# EasyEDA Pro project RBrick.eprj

# Schematic Schematic1
Board Name: Brick; Create Date: 2026-04-28; Page Name: P1; Project Name: RBrick; Schematic Name: Schematic1; Update Date: 2026-05-01; Company: EasyEDA.com; Page Size: A4; Version: V1.0
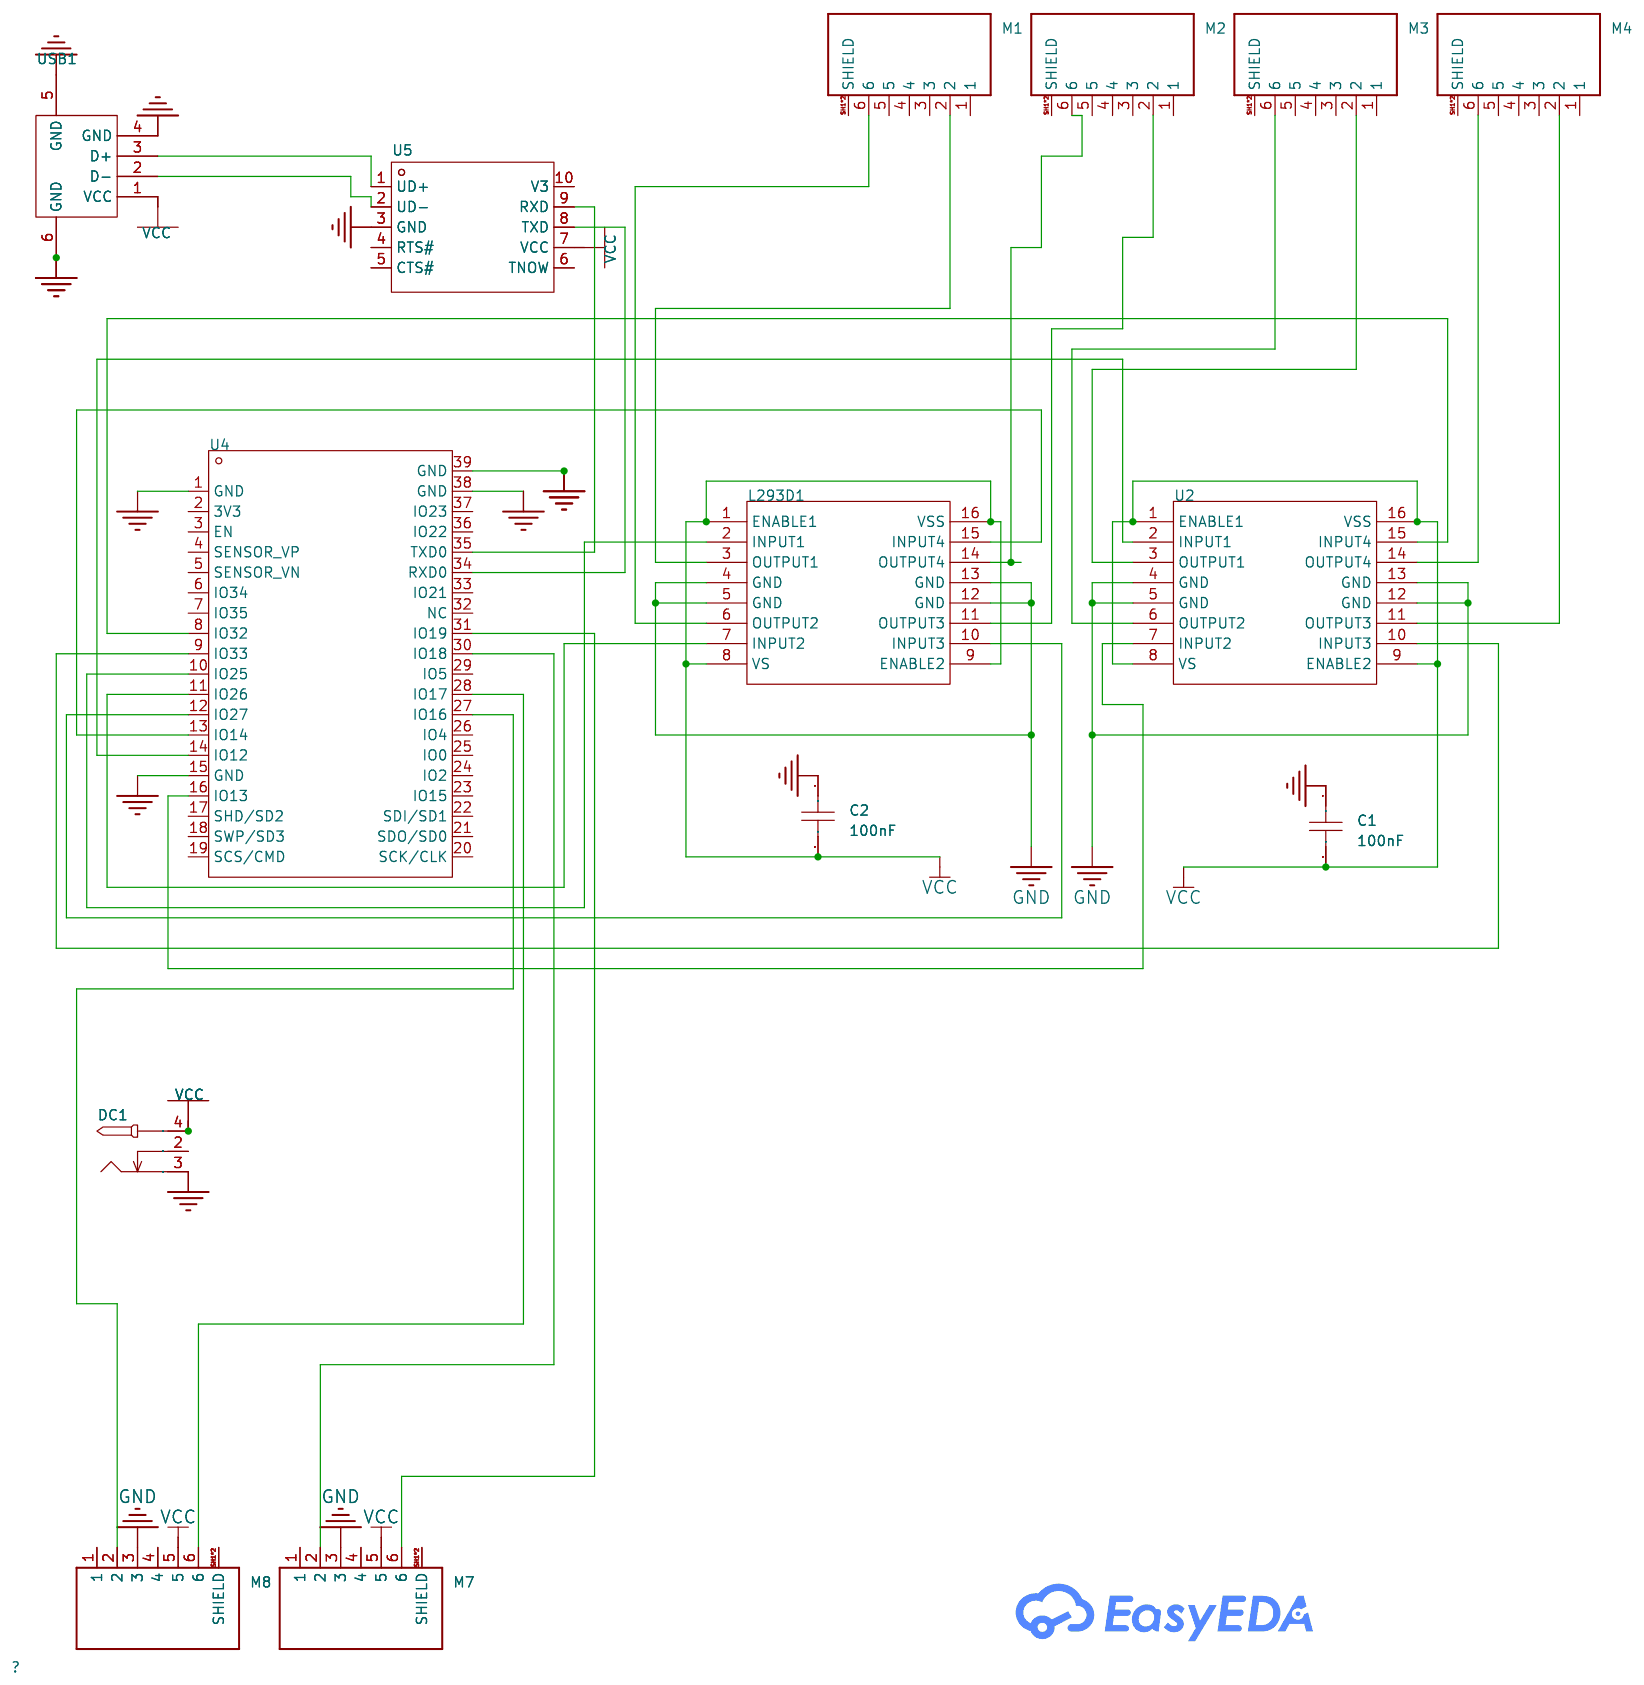
[diagram p0: schematic sheet]

## Parts
C1  100nF  [C0201]
C2  100nF  [C0201]
DC1  -  [DC-IN-TH_DC-5520-1]
L293D1  L293D  [DIP-16_L20.0-W6.4-P2.54-LS7.6-BL]
M1  RJ11-6N4-B  [TE_RJ11-6N4-B]
M2  RJ11-6N4-B  [TE_RJ11-6N4-B]
M3  RJ11-6N4-B  [TE_RJ11-6N4-B]
M4  RJ11-6N4-B  [TE_RJ11-6N4-B]
M7  RJ11-6N4-B  [TE_RJ11-6N4-B]
M8  RJ11-6N4-B  [TE_RJ11-6N4-B]
U2  L293D  [DIP-16_L20.0-W6.4-P2.54-LS7.6-BL]
U4  -  [WIFIM-SMD_ESP-32S]
U5  -  [MSOP-10_L3.0-W3.0-P0.50-LS5.0-BL]
USB1  -  [USB-A-TH_USB-302-T]

## Library data of the parts
C1 C2 = CAP_0201: Supplier Footprint: 0201
DC1 = DC-005_2.0: Supplier Footprint: Through
L293D1 U2 = L293D_C12340: LCSC Part Name: 600mA 有刷直流电机驱动芯片 36V; Supplier Part: C12340; Manufacturer: ST(意法半导体); Supplier Footprint: DIP-16; JLCPCB Part Class: Extended Part; Datasheet: https://item.szlcsc.com/datasheet/L293D/12963.html; Supplier: LCSC; Number of H-bridges: 2; Output Current: 600mA; Peak Current: 1.2A; Voltage - Supply: 4.5V~36V; Quiescent Current(Iq): 4mA; Operating Temperature: -40℃~+150℃
M1-M4 M7 M8 = RJ11-6N4-B
U4 = ESP32-WROOM-32: Supplier Part: C82899; Manufacturer: ESPRESSIF(乐鑫); Supplier Footprint: WIFI无线 Module; JLCPCB Part Class: Extended Part; Datasheet: https://atta.szlcsc.com/upload/public/pdf/source/20210719/C82899_2D52724B6FAFABC419BCF308C5944296.pdf; Supplier: LCSC
U5 = CH340E: Supplier Part: C99652; Manufacturer: WCH(南京沁恒); Supplier Footprint: MSOP-10; JLCPCB Part Class: Extended Part; Datasheet: https://atta.szlcsc.com/upload/public/pdf/source/20200819/C99652_97FFC0DF2539BFF05CD752AD9221D632.pdf; Supplier: LCSC
USB1 = USB-302-T: LCSC Part Name: Type-A 母座 弯插 普通内扣; Supplier Part: C112456; Manufacturer: SOFNG(硕方); Supplier Footprint: 插件; JLCPCB Part Class: Extended Part; Datasheet: https://atta.szlcsc.com/upload/public/pdf/source/20200911/C112456_D145FFFFE3DACD885934CCE0492128DC.pdf; Supplier: LCSC; Connector Type: Type-A; Standard: USB 2.0; Gender: Female; Number of Contacts: 4; Number of Ports: 1; Mounting Style: Shrouded; Current Rating - Power (Max): 50mA; Operating Temperature Range: -25℃~+75℃

## Nets
GND: C1.1 C2.1 DC1.3 L293D1.4(GND) L293D1.5(GND) L293D1.12(GND) L293D1.13(GND) M7.3 M8.3 U2.4(GND) U2.5(GND) U2.12(GND) U2.13(GND) U4.1(GND) U4.15(GND) U4.38(GND) U4.39(GND) U5.3(GND) USB1.4(GND) USB1.5(GND) USB1.6(GND)
VCC: C1.2 C2.2 DC1.4 L293D1.1(ENABLE1) L293D1.8(VS) L293D1.9(ENABLE2) L293D1.16(VSS) M7.5 M8.5 U2.1(ENABLE1) U2.8(VS) U2.9(ENABLE2) U2.16(VSS) U5.7(VCC) USB1.1(VCC)
$1N3161: U2.2(INPUT1) U4.14(IO12)
$1N3822: M3.2 U2.3(OUTPUT1)
$1N3830: M3.6 U2.6(OUTPUT2)
$1N4240: L293D1.3(OUTPUT1) M1.2
$1N4275: M4.2 U2.11(OUTPUT3)
$1N4279: M4.6 U2.14(OUTPUT4)
$1N4306: L293D1.6(OUTPUT2) M1.6
$1N4375: L293D1.11(OUTPUT3) M2.2
$1N4424: L293D1.14(OUTPUT4) M2.6
$1N5365: M8.2 U4.27(IO16)
$1N5372: M8.6 U4.28(IO17)
$1N5379: M7.2 U4.30(IO18)
$1N5395: M7.6 U4.31(IO19)
$1N6263: U2.7(INPUT2) U4.16(IO13)
$1N6284: L293D1.15(INPUT4) U4.13(IO14)
$1N6746: L293D1.2(INPUT1) U4.10(IO25)
$1N6757: L293D1.7(INPUT2) U4.11(IO26)
$1N6766: L293D1.10(INPUT3) U4.12(IO27)
$1N6927: U2.15(INPUT4) U4.8(IO32)
$1N6935: U2.10(INPUT3) U4.9(IO33)
$1N9235: U5.2(UD-) USB1.2(D-)
$1N9237: U5.1(UD+) USB1.3(D+)
$1N9498: U4.35(TXD0) U5.9(RXD)
$1N9505: U4.34(RXD0) U5.8(TXD)

Not connected (* = marked no-connect by the designer): DC1 2; M1 1 3 4 5 SH1*2(SHIELD); M2 1 3 4 5 SH1*2(SHIELD); M3 1 3 4 5 SH1*2(SHIELD); M4 1 3 4 5 SH1*2(SHIELD); M7 1 4 SH1*2(SHIELD); M8 1 4 SH1*2(SHIELD); U4 2(3V3) 3(EN) 4(SENSOR_VP) 5(SENSOR_VN) 6(IO34) 7(IO35) 17(SHD/SD2) 18(SWP/SD3) 19(SCS/CMD) 20(SCK/CLK) 21(SDO/SD0) 22(SDI/SD1) 23(IO15) 24(IO2) 25(IO0) 26(IO4) 29(IO5) 32(NC) 33(IO21) 36(IO22) 37(IO23); U5 4(RTS#) 5(CTS#) 6(TNOW) 10(V3)

# Board PCB1
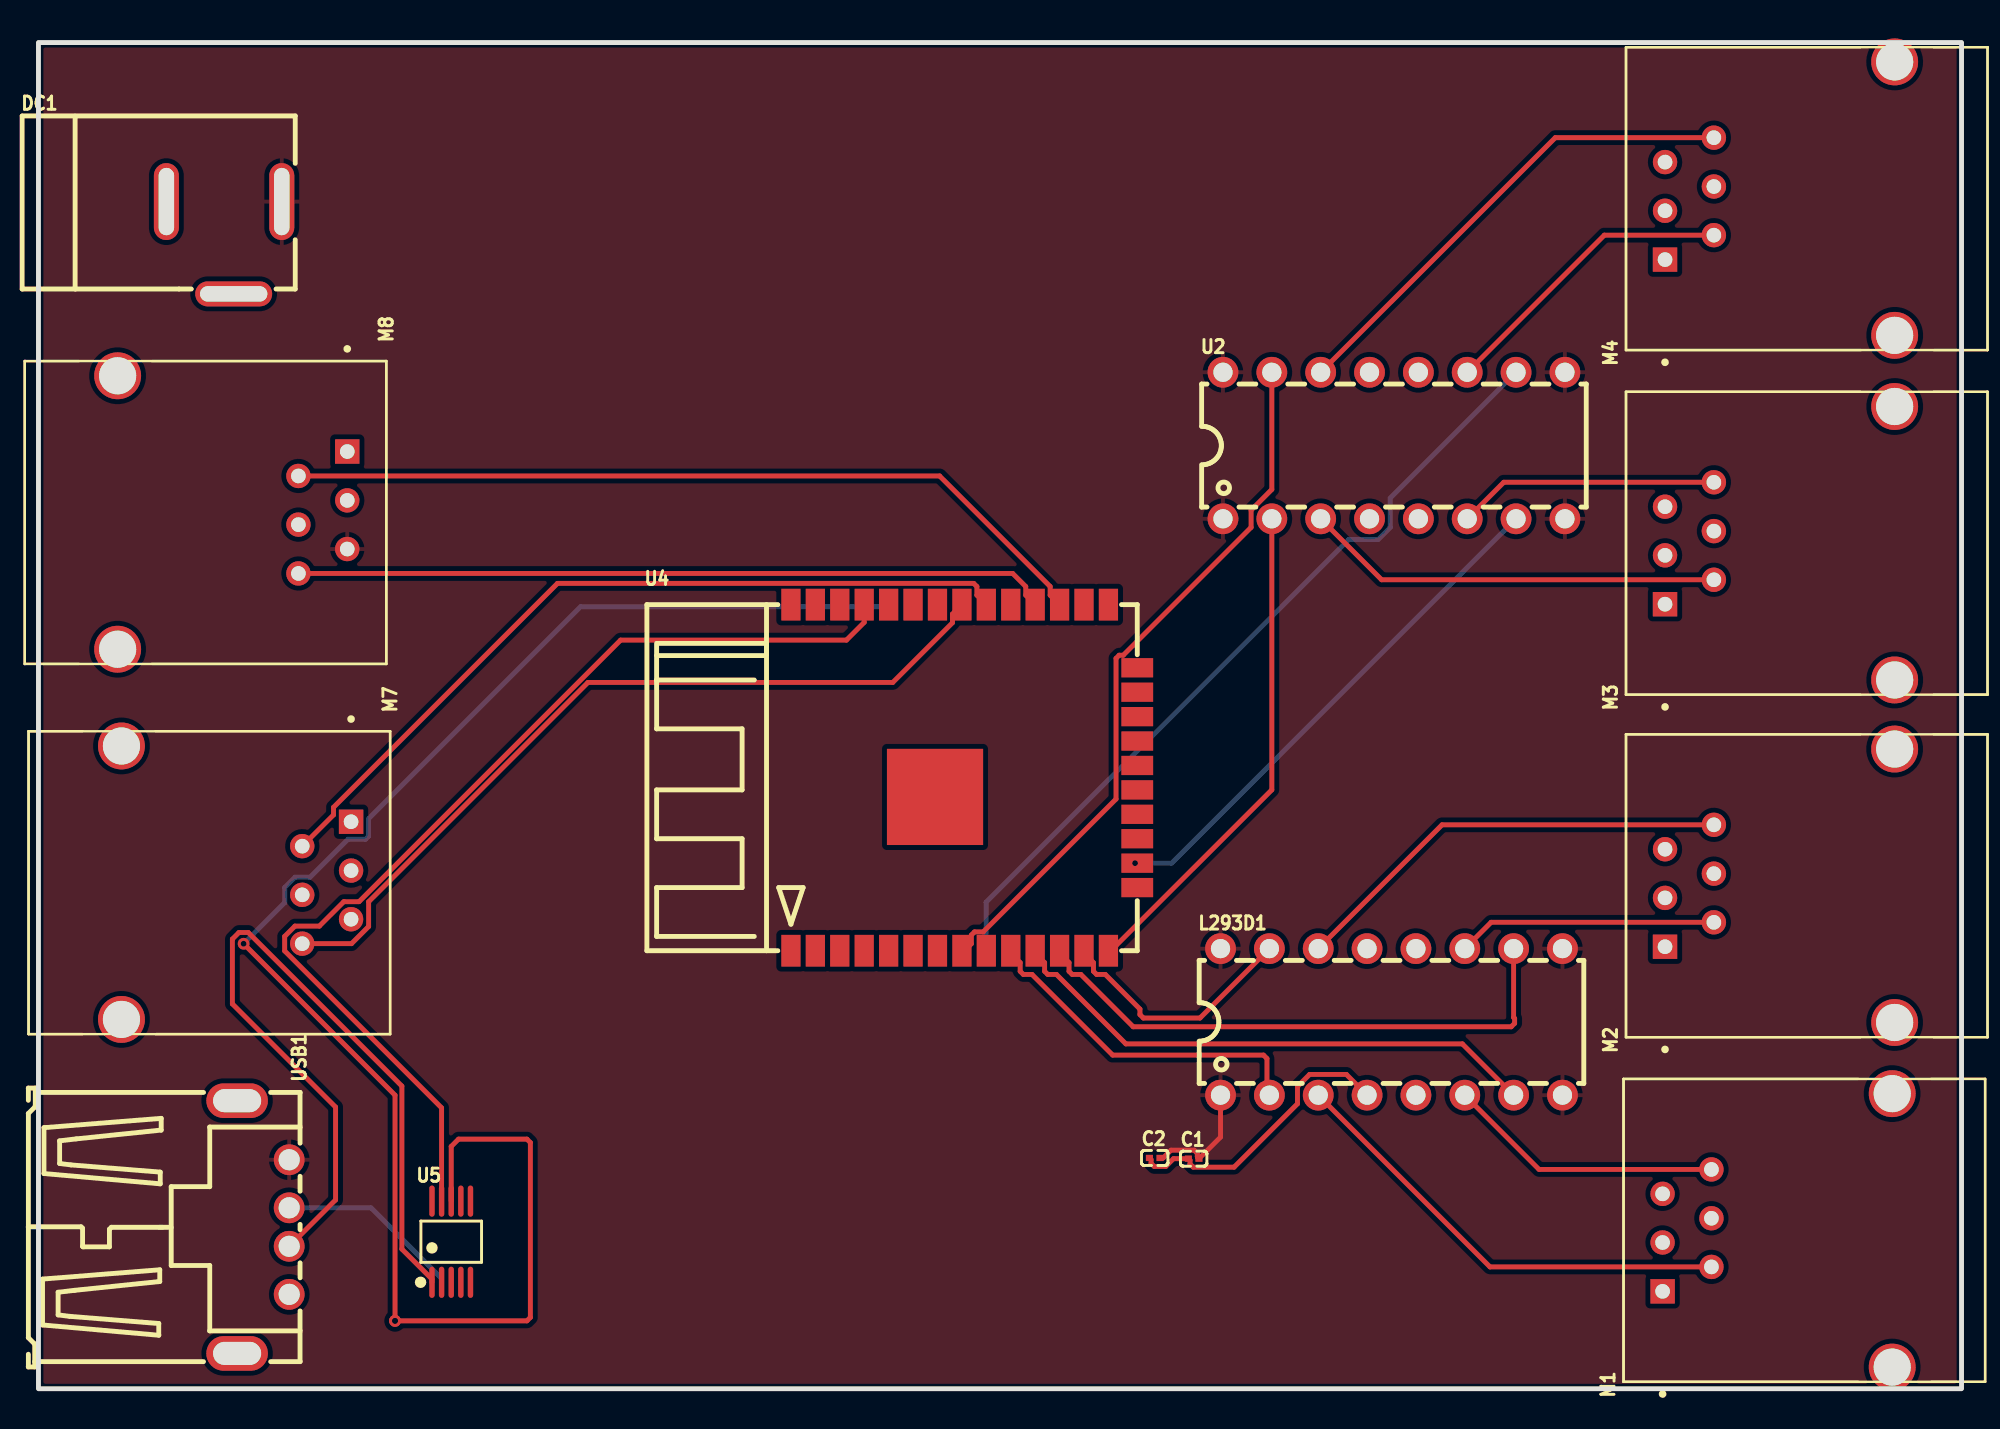
[diagram p1: board, top side]
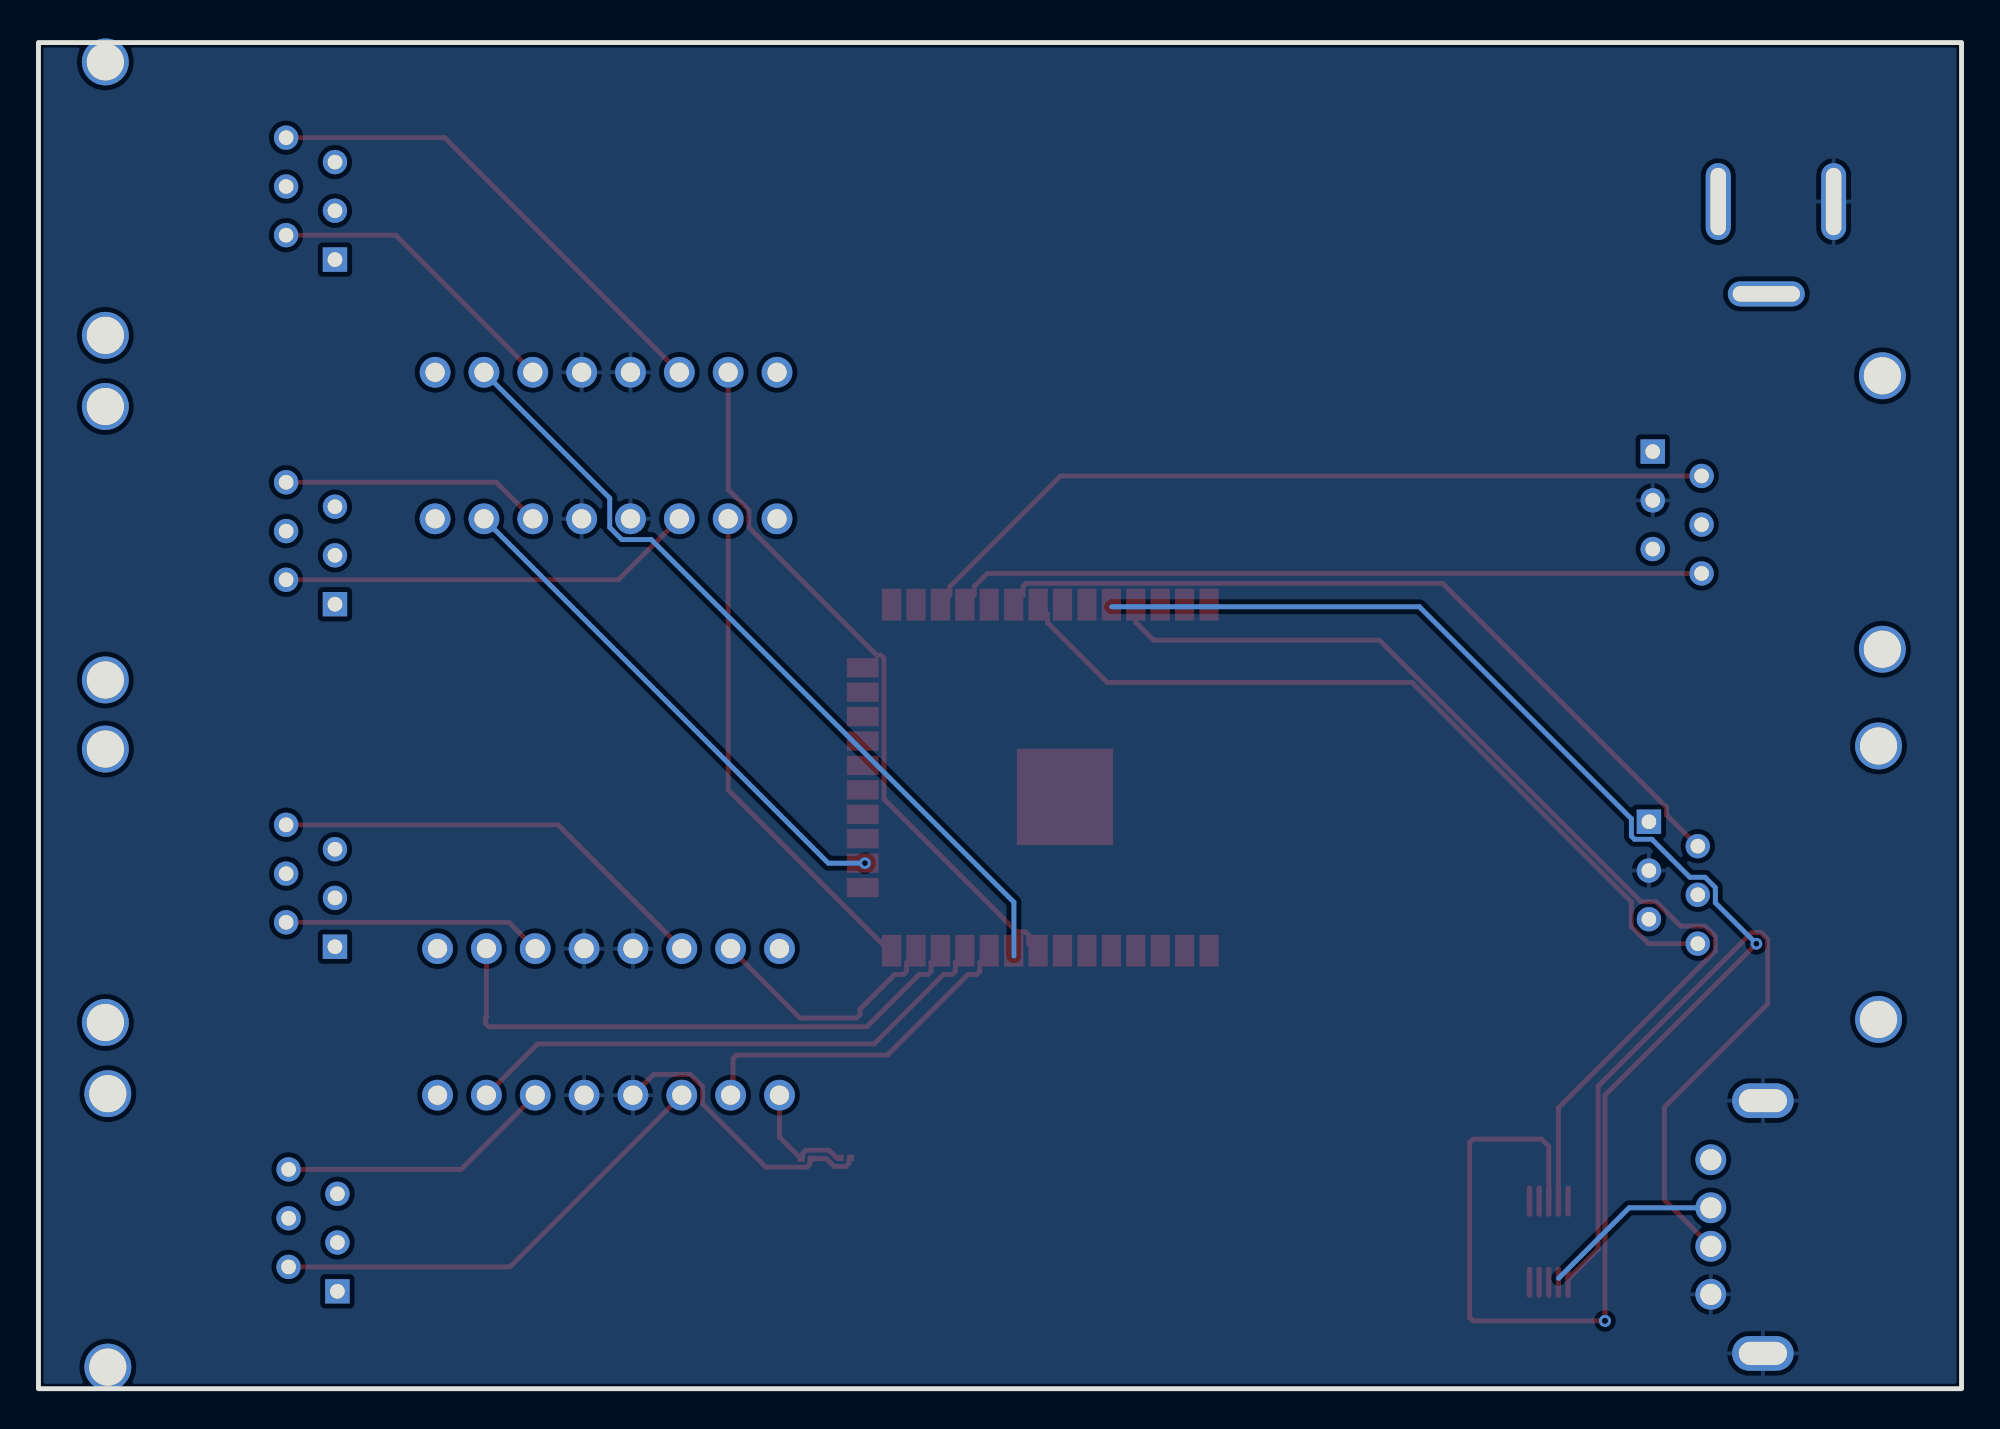
[diagram p2: board, bottom side, seen from below]

Outline 100 x 70 mm; copper layers: Top Layer, Bottom Layer. Coordinates in mm from the lower left corner of the outline.
Outline path: rectangle 0,70 100,0
Stack: Top Layer 0.035mm / Dielectric1 1.51mm FR4 er 4.5 / Bottom Layer 0.035mm

## Design rules (mm)
net VCC: DP1
net GND: DP1
template: JLCPCB Capability(Two Layers Board)
spacing copperThickness1oz (default): track to track 0.102, other pairs 0.152 to 0.3
spacing copperThickness2oz: track to track 0.203, other pairs 0.152 to 0.3
track width copperThickness1oz (default): min 0.127, default 0.254, max 2.54
track width copperThickness2oz: min 0.203, default 0.254, max 2.54
differential pair differentialPair (default): width min 0.127, default 0.254, max 2.54; gap min 0.152, default 0.152
via viaSize (default): diameter min 0.5, default 0.61, max 10; hole min 0.3, default 0.305, max 6.3

## Placement (name value [footprint] x y rotation side)
C1  100nF  [C0201]  60.07 11.96 0 top
C2  100nF  [C0201]  58.04 12 0 top
DC1  -  [DC-IN-TH_DC-5520-1]  9.65 59.33 0 top
L293D1  L293D  [DIP-16_L20.0-W6.4-P2.54-LS7.6-BL]  70.36 19.07 0 top
M1  RJ11-6N4-B  [TE_RJ11-6N4-B]  93.35 8.23 90 top
M2  RJ11-6N4-B  [TE_RJ11-6N4-B]  93.47 26.15 90 top
M3  RJ11-6N4-B  [TE_RJ11-6N4-B]  93.47 43.97 90 top
M4  RJ11-6N4-B  [TE_RJ11-6N4-B]  93.47 61.89 90 top
M7  RJ11-6N4-B  [TE_RJ11-6N4-B]  7.37 26.31 270 top
M8  RJ11-6N4-B  [TE_RJ11-6N4-B]  7.17 45.56 270 top
U2  L293D  [DIP-16_L20.0-W6.4-P2.54-LS7.6-BL]  70.48 49.05 0 top
U4  -  [WIFIM-SMD_ESP-32S]  48.13 31.77 0 top
U5  -  [MSOP-10_L3.0-W3.0-P0.50-LS5.0-BL]  21.46 7.64 0 top
USB1  -  [USB-A-TH_USB-302-T]  11.68 8.41 270 top

## Footprints (pads in the part's own frame, mm; a bottom-side part is the same pattern mirrored in y, then rotated)
C0201
  rect 0.368x0.324 smd: 1(-0.275,0) 2(0.275,0)
DC-IN-TH_DC-5520-1
  oval 4x1.3 hole 3.5x0.8: 2(0.5,-2.4)
  oval 1.3x4 hole 0.8x3.5: 3(-3,2.4) 4(3,2.4)
DIP-16_L20.0-W6.4-P2.54-LS7.6-BL
  round 1.6 hole 1: 1(-8.89,-3.81) 2(-6.35,-3.81) 3(-3.81,-3.81) 4(-1.27,-3.81) 5(1.27,-3.81) 6(3.81,-3.81) 7(6.35,-3.81) 8(8.89,-3.81) 9(8.89,3.81) 10(6.35,3.81) 11(3.81,3.81) 12(1.27,3.81) 13(-1.27,3.81) 14(-3.81,3.81) 15(-6.35,3.81) 16(-8.89,3.81)
MSOP-10_L3.0-W3.0-P0.50-LS5.0-BL
  oval 0.28x1.621 smd: 1(-1.001,-2.111) 2(-0.5,-2.111) 3(0,-2.111) 4(0.5,-2.111) 5(1.001,-2.111) 6(1.001,2.111) 7(0.5,2.111) 8(0,2.111) 9(-0.5,2.111) 10(-1.001,2.111)
TE_RJ11-6N4-B
  rect 1.268x1.268 hole 0.76: 1(-3.17,8.89)
  round 1.268 hole 0.76: 2(-1.9,6.35) 3(-0.63,8.89) 4(0.63,6.35) 5(1.9,8.89) 6(3.17,6.35)
  round 2.438 hole 1.93: SH1(-7.11,-3.05) SH2(7.11,-3.05)
USB-A-TH_USB-302-T
  round 1.6 hole 1.1: 1(-3.5,1.354) 2(-1.001,1.354) 3(1.001,1.354) 4(3.5,1.354)
  oval 1.801x3.2 hole 1.199x2.499: 5(-6.571,-1.354) 6(6.571,-1.354)
WIFIM-SMD_ESP-32S
  rect 1.001x1.651 smd: 1(-9.005,-8.999) 2(-7.734,-8.999) 3(-6.465,-8.999) 4(-5.194,-8.999) 5(-3.925,-8.999) 6(-2.655,-8.999) 7(-1.385,-8.999) 8(-0.115,-8.999) 9(1.155,-8.999) 10(2.425,-8.999) 11(3.696,-8.999) 12(4.965,-8.999) 13(6.236,-8.999) 14(7.505,-8.999) 25(7.505,8.999) 26(6.236,8.999) 27(4.965,8.999) 28(3.696,8.999) 29(2.425,8.999) 30(1.155,8.999) 31(-0.115,8.999) 32(-1.385,8.999) 33(-2.655,8.999) 34(-3.925,8.999) 35(-5.194,8.999) 36(-6.465,8.999) 37(-7.734,8.999) 38(-9.005,8.999)
  rect 1.651x1.001 smd: 15(9.005,-5.715) 16(9.005,-4.445) 17(9.005,-3.175) 18(9.005,-1.905) 19(9.005,-0.635) 20(9.005,0.635) 21(9.005,1.905) 22(9.005,3.175) 23(9.005,4.445) 24(9.005,5.715)
  rect 5.002x5.002 smd: 39(-1.512,-1.001)

## Nets
As in the schematic.

Pads without a net: DC1 2; M1 1 3 4 5 SH1 SH2; M2 1 3 4 5 SH1 SH2; M3 1 3 4 5 SH1 SH2; M4 1 3 4 5 SH1 SH2; M7 1 4 SH1 SH2; M8 1 4 SH1 SH2; U4 2 3 4 5 6 7 17 18 19 20 21 22 23 24 25 26 29 32 33 36 37; U5 4 5 6 10

## Via types
v1: diameter 0.61, hole 0.305, Top Layer to Bottom Layer, 5 vias

## Routing (per net, layer and track width the routed paths; a pad name or vN(x,y) marks a point on that pad's centre or on a via; arc(x,y) is an arc through that point)
GND: length 15
  Top Layer w0.254: C2.1 57.86,11.91 57.86,11.72 58.02,11.56 58.62,11.56 59.02,11.96 C1.1 59.88,11.88 59.88,11.68 60.05,11.52 62.17,11.52 65.47,14.82 65.47,15.71 66.1,16.34 68.01,16.34 69.09,15.26
VCC: length 6.3
  Top Layer w0.254: C2.2 58.48,12 58.89,12.4 60.1,12.4 60.26,12.24 60.26,12.07 60.29,12.04 60.29,12.02 C1.2 61.47,13.08 L293D1.1
$1N3161: length 26.1
  Top Layer w0.254: U2.2 64.14,31.14 55.64,22.65
$1N3822: length 21.8
  Top Layer w0.254: U2.3 69.85,42.07 M3.2
$1N3830: length 13.6
  Top Layer w0.254: M3.6 76.2,47.14 U2.6
$1N4240: length 24.1
  Top Layer w0.254: L293D1.3 75.48,6.33 M1.2
$1N4275: length 15.8
  Top Layer w0.254: M4.2 81.42,59.98 U2.11
$1N4279: length 25.5
  Top Layer w0.254: M4.6 78.87,65.06 U2.14
$1N4306: length 14.4
  Top Layer w0.254: M1.6 78.03,11.4 L293D1.6
$1N4375: length 13.5
  Top Layer w0.254: L293D1.11 75.54,24.25 M2.2
$1N4424: length 23.2
  Top Layer w0.254: L293D1.14 72.99,29.32 M2.6
$1N5365: length 42.6
  Top Layer w0.254: U4.27 52.61,41.26 52.61,41.71 46.86,47.46 M8.2
$1N5372: length 39.2
  Top Layer w0.254: M8.6 50.66,42.39 51.34,41.71 51.34,41.26 U4.28
$1N5379: length 42.2
  Top Layer w0.254: M7.2 15.34,29.84 15.34,30.23 26.99,41.88 48.63,41.88 48.8,41.71 48.8,41.26 U4.30
$1N5395: length 42.6
  Top Layer w0.254: M7.6 16.28,23.14 17.17,24.03 17.17,25.32 28.58,36.73 44.42,36.73 47.53,39.83 47.53,40.28 U4.31
$1N6263: length 27.2
  Bottom Layer w0.254: v1(57.02,27.33) 58.93,27.33 U2.7
$1N6284: length 13
  Top Layer w0.254: L293D1.15 60.4,19.27 57.46,19.27 57.28,19.45 57.28,19.74 55.47,21.54 55.02,21.54 54.86,21.71 54.86,22.16 54.37,22.65
$1N6746: length 17.8
  Top Layer w0.254: 50.56,22.65 51.05,22.16 51.05,21.71 51.21,21.54 51.66,21.54 55.86,17.35 63.7,17.35 63.88,17.17 63.88,15.39 L293D1.2
$1N6757: length 28.2
  Top Layer w0.254: 51.83,22.65 52.32,22.16 52.32,21.71 52.48,21.54 52.93,21.54 56.55,17.93 74.04,17.93 76.71,15.26
$1N6766: length 29.5
  Top Layer w0.254: 53.1,22.65 53.59,22.16 53.59,21.71 53.75,21.54 54.2,21.54 56.93,18.82 76.58,18.82 76.76,19 76.76,19.25 76.71,19.31 76.71,22.88
$1N6927: length 37.3
  Top Layer w0.254: U2.15 64.14,46.76 63.06,45.68 63.06,44.79 56.41,38.14 56.2,38.14 56.03,37.98 56.03,30.66 49.12,23.75 48.67,23.75 48.51,23.59 48.51,23.14 48.02,22.65
$1N6935: length 42.7
  Bottom Layer w0.254: v1(76.83,52.86) 70.29,46.31 70.29,44.79 69.66,44.16 68.14,44.16 49.28,25.3 49.28,22.5
$1N9235: length 9.4
  Bottom Layer w0.254: 20.95,5.74 17.29,9.41 USB1.2
$1N9237: length 42.3
  Top Layer w0.254: USB1.3 15.45,9.82 15.45,14.64 10.08,20.01 10.08,23.38 10.43,23.72 10.91,23.72 18.9,15.73 18.9,7.26 20.46,5.7 U5.1
$1N9498: length 55
  Top Layer w0.254: U4.35 42.94,39.85 42.02,38.93 30.27,38.93 16.67,25.33 15.88,25.33 14.61,24.06 13.34,24.06 12.8,23.52 12.8,22.76 20.96,14.6 U5.9
$1N9505: length 88
  Top Layer w0.254: U5.8 21.46,12.6 21.84,12.98 25.4,12.98 25.58,12.8 25.58,3.71 25.4,3.53 v1(18.54,3.53) 18.54,15.26 v1(10.67,23.14)
  Bottom Layer w0.254: v1(10.67,23.14) 12.8,25.27 12.8,26.06 13.34,26.59 14.13,26.59 16.1,28.57 17.01,28.57 17.17,28.73 17.17,29.64 28.19,40.66 44.2,40.66

## Copper pours and planes (outline as drawn; the poured copper is in the pictures)
GND on Bottom Layer: -11.81,77.62 110.36,77.62 110.36,-6.71 -11.81,-6.71
VCC on Top Layer: -16.26,73.68 110.62,73.68 110.62,-10.26 -16.26,-10.26
